# Altium project DRAGAO_MK_TWO.PrjPcb
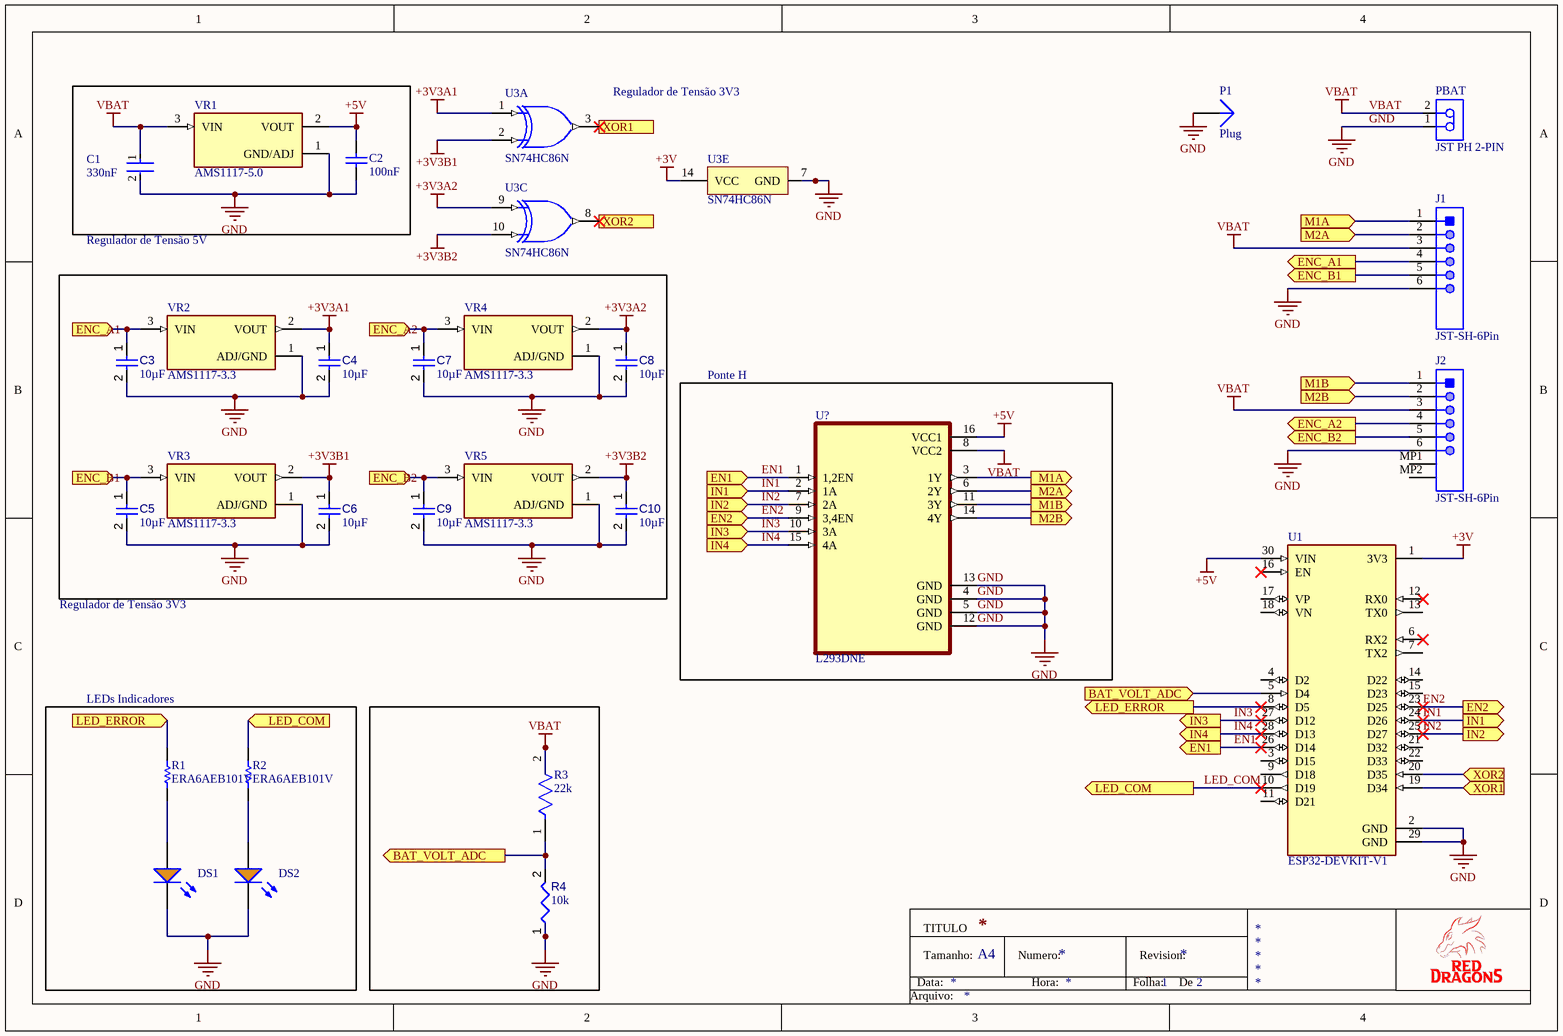
[diagram p0: Energia.SchDoc]
1 sheet, 28 parts. Net scope: flat (ports and power ports of the same name join across sheets).
Board file: PCB2.PcbDoc

## Sheet Energia.SchDoc
size A4; SheetNumber: 1; SheetTotal: 2

### Parts
C1  330nF  [FP-0805-L_2_01_0_2-W_1_25-IPC_B]
C2  100nF  [CAPC2013X140X50LL20T25]
C3  value 10µF  [CAPC2013X135X45NL10T25]  (hidden comment: Capacitor 10 uF +/- 10% 16 V 0805)
C4  value 10µF  [CAPC2013X135X45NL10T25]  (hidden comment: Capacitor 10 uF +/- 10% 16 V 0805)
C5  value 10µF  [CAPC2013X135X45NL10T25]  (hidden comment: Capacitor 10 uF +/- 10% 16 V 0805)
C6  value 10µF  [CAPC2013X135X45NL10T25]  (hidden comment: Capacitor 10 uF +/- 10% 16 V 0805)
C7  value 10µF  [CAPC2013X135X45NL10T25]  (hidden comment: Capacitor 10 uF +/- 10% 16 V 0805)
C8  value 10µF  [CAPC2013X135X45NL10T25]  (hidden comment: Capacitor 10 uF +/- 10% 16 V 0805)
C9  value 10µF  [CAPC2013X135X45NL10T25]  (hidden comment: Capacitor 10 uF +/- 10% 16 V 0805)
C10  value 10µF  [CAPC2013X135X45NL10T25]  (hidden comment: Capacitor 10 uF +/- 10% 16 V 0805)
DS1  LTST-C190KFKT  [LTST-C190KFKT_V]  (value not drawn)
DS2  LTST-C190KFKT  [LTST-C190KFKT_V]  (value not drawn)
J1  JST-SH-6Pin  [JST-SM06B-SRSS-TB_V]
J2  JST-SH-6Pin  [JST-SM06B-SRSS-TB_V]
P1  Plug  [PIN1]
PBAT  JST PH 2-PIN  [JST-B2B-PH-K-S_V]
R1  ERA6AEB101V  [RESC2013X60X40ML20T25]
R2  ERA6AEB101V  [RESC2013X60X40ML20T25]
R3  22k  [FP-CR0805-IPC_B]
R4  value 10k  [RESC2013X50X35ML15T15]  (hidden comment: Resistor 10k +/-1% 0805 125 mW)
U1  ESP32-DEVKIT-V1  [MODULE_ESP32_DEVKIT_V1]
U3  SN74HC86N  [N0014A]  (parts A,C,E of 5)
U?  L293DNE  [DIP762W45P254L1980H508Q16]
VR1  AMS1117-5.0  [SOT229P700X180-4N]
VR2  AMS1117-3.3  [SOT229P700X180-4N]
VR3  AMS1117-3.3  [SOT229P700X180-4N]
VR4  AMS1117-3.3  [SOT229P700X180-4N]
VR5  AMS1117-3.3  [SOT229P700X180-4N]

### Blocks framed on the sheet
Ponte H: U?
LEDs Indicadores: DS1 DS2 R1 R2

### Ports
BAT_VOLT_ADC (in), BAT_VOLT_ADC (out), EN1 (in), EN1 (out), EN2 (in), EN2 (out), ENC_A1 (in), ENC_A1 (out), ENC_A2 (in), ENC_A2 (out), ENC_B1 (in), ENC_B1 (out), ENC_B2 (in), ENC_B2 (out), IN1 (in), IN1 (out), IN2 (in), IN2 (out), IN3 (in), IN3 (out), IN4 (in), IN4 (out), LED_COM (in), LED_COM (out), LED_ERROR (in), LED_ERROR (out), M1A (in), M1A (out), M1B (in), M1B (out), M2A (in), M2A (out), M2B (in), M2B (out), XOR1 (in), XOR1 (out), XOR2 (in), XOR2 (out)

### Nets
+3V: U1.1(3V3) U3.14(VCC)
+3V3A1: C4.1 U3.1(1A) VR2.2(VOUT)
+3V3A2: C8.1 U3.9(3A) VR4.2(VOUT)
+3V3B1: C6.1 U3.2(1B) VR3.2(VOUT)
+3V3B2: C10.1 U3.10(3B) VR5.2(VOUT)
+5V: C2.2 U1.30(VIN) U?.16(VCC1) VR1.2(VOUT)
GND: C1.2 C2.1 C3.2 C4.2 C5.2 C6.2 C7.2 C8.2 C9.2 C10.2 DS1.2(K) DS2.2(K) J1.6 J2.6 P1.1 PBAT.1 R4.1 U1.2(GND) U1.29(GND) U3.7(GND) U?.4(GND) U?.5(GND) U?.12(GND) U?.13(GND) VR1.1(GND/ADJ) VR2.1(ADJ/GND) VR3.1(ADJ/GND) VR4.1(ADJ/GND) VR5.1(ADJ/GND)
VBAT: C1.1 J1.3 J2.3 PBAT.2 R3.2 U?.8(VCC2) VR1.3(VIN)
EN1: U1.26(D14) U?.1(1,2EN) ; port EN1
EN2: U1.23(D25) U?.9(3,4EN) ; port EN2
IN1: U1.24(D26) U?.2(1A) ; port IN1
IN2: U1.25(D27) U?.7(2A) ; port IN2
IN3: U1.27(D12) U?.10(3A) ; port IN3
IN4: U1.28(D13) U?.15(4A) ; port IN4
LED_COM: R2.2 U1.10(D19) ; port LED_COM
NetC3_1: C3.1 J1.4 VR2.3(VIN) ; port ENC_A1
NetC5_1: C5.1 J1.5 VR3.3(VIN) ; port ENC_B1
NetC7_1: C7.1 J2.4 VR4.3(VIN) ; port ENC_A2
NetC9_1: C9.1 J2.5 VR5.3(VIN) ; port ENC_B2
NetDS1_1: DS1.1(A) R1.1
NetDS2_1: DS2.1(A) R2.1
NetJ1_1: J1.1 U?.3(1Y) ; port M1A
NetJ1_2: J1.2 U?.6(2Y) ; port M2A
NetJ2_1: J2.1 U?.11(3Y) ; port M1B
NetJ2_2: J2.2 U?.14(4Y) ; port M2B
NetR1_2: R1.2 U1.8(D5) ; port LED_ERROR
NetR3_1: R3.1 R4.2 U1.5(D4) ; port BAT_VOLT_ADC
NetU1_19: U1.19(D34) U3.3(1Y) ; port XOR1
NetU1_20: U1.20(D35) U3.8(3Y) ; port XOR2

Not connected (* = marked no-connect by the designer): J2 MP1 MP2; U1 3(D15) 4(D2) 6(RX2)* 7(TX2) 9(D18) 11(D21) 12(RX0)* 13(TX0) 14(D22) 15(D23) 16(EN)* 17(VP) 18(VN) 21(D32) 22(D33)

### Notes on the sheet
- (near U3) Regulador de Tensão 3V3
- Regulador de Tensão 5V
- Regulador de Tensão 3V3
- Data:
- TITULO
- Tamanho:
- A4
- Numero:
- Hora:
- Folha:
- Revision:
- De
- Arquivo:

### Library data of the parts
C1 = CMP-2007-04657-2: General Purpose Ceramic Capacitor, 0805, 330nF, 10%, X7R, 15%, 16V; Dissipation Factor: 3.5%; Insulation Resistance: 100GR; RoHS Compliant: Yes; Tolerance: 10%; Packaging: Tape and Reel; Radiation Hardening: No; Depth: 1.25mm; Voltage Rating (DC): 16V; Height: 1.4mm; Package Quantity: 1; Case Code (Imperial): 0805; Min Operating Temperature: -55°C; Thickness: 0.055inch; REACH SVHC: No SVHC; Capacitance: 330nF; Voltage Rating: 16V; Size: 1.4mm; Case Code (Metric): 2012; Width: 1.25mm; Max Operating Temperature: 125°C; Voltage: 16V; Series: -; Mount: Surface Mount; Dielectric: X7R; Termination: SMD/SMT; Number of Pins: 2; Contact Plating: Tin; Lead Free: Lead Free; Construction: Flat; Case/Package: 0805; Length: 2.01mm
C2 = CMP-2007-04746-1: Manufacturer: AVX Interconnect / Elco; Part Number: 08055C104K4T4A
C3-C10 = CMP-001-00015-6: Chip Capacitor, 10 uF, +/- 10%, 16 V, 0805 (2012 Metric); Voltage Rating: 16V; Capacitor Type: Ceramic; RoHS Compliant: True; Max Operating Temperature: 85°C; Min Operating Temperature: -55°C; Mounting Technology: SM; Tolerance: 10%; Case/Package: 0805; Pins: 2
DS1 DS2 = CMP-007-00023-2: LED Uni-Color Orange, 75 mW, 30 mA, -35 to 85 degC, 2-Pin SMD, RoHS, Tape and Reel; Manufacturer: Lite-On; Power: 75mW; Luminous Intensity: 90mcd; Nominal Vf: 2V; Lens Style: Diffused; Forward Current: 20mA; Viewing Angle: 130degrees; Max Operating Temperature: 85°C; Manufacturer URL: http://www.us.liteon.com/; Package Description: 2-Pin Surface Mount Device, Body 1.6 x 0.8 mm; Package Quantity: 3000; Pins: 2; Min Operating Temperature: -55°C; Mounting Technology: SM; Colour: Orange; Packaging: TapeandReel; Case/Package: 0603; Datasheet Version: Rev. I, 09/2011; Illumination Colour: Orange; Datasheet URL: http://optoelectronics.liteon.com/upload/download/DS-22-99-0186/S_110_LTST-C190KFKT.pdf; Package Reference: C190KFKT; RoHS Compliant: True; Forward Voltage: 2V
J1 J2 = CMP-2000-07080-1: Male Header, Pitch 1 mm, 1 x 6 Position, Height 2.95 mm, -25 to 85 degC, RoHS, Tape and Reel; Manufacturer: JST; No of Positions: 6; Pitch: 1mm; Style/Orientation: RightAngleHeader/Plug; Datasheet URL: https://datasheet.ciiva.com/26894/getdatasheetpartid-708885-26894671.pdf; Package Description: Male Header, Pitch 1 mm, 1 X 6 Position, Height 2.9 mm; Termination: Solder; Manufacturer URL: http://www.jst.com/home2.html; Type: ShroudedHeader; Package Reference: SM06B-SRSS-TB; Datasheet Version: 11/2010; Mounting Technology: SurfaceMount
PBAT = CMP-2000-05162-1: Male Header, Pitch 2 mm, 1 x 2 Position, Height 6 mm, Tail Length 3.4 mm, -25 to 85 degC, RoHS, Bulk; Pitch: 2mm; Style/Orientation: StraightHeader/Plug; No of Positions: 2; Datasheet Version: Nov-08; Datasheet URL: http://datasheet.octopart.com/B2B-PH-K-S%28LF%29%28SN%29-JST-datasheet-8324864.pdf; Manufacturer URL: http://www.jst.com/home2.html; Type: ShroudedHeader; Termination: Crimp; Manufacturer: JST
R1 R2 = CMP-2001-00580-1: Manufacturer: Panasonic; Part Number: ERA6AEB101V
R3 = CMP-07231-001007-1: Thick Film Chip Resistors 0805 22kΩ 0.125W 5% 200ppm/°C; Voltage Rating: 150V; Resistance: 22kR; Power Rating: 125mW; Width: 1.25mm; Packaging: Tape and Reel; Max Operating Temperature: 155°C; Case/Package: 0805; Length: 2mm; Thickness: 508um; Military Standard: Not; Height: 0.5mm; Case Code (Metric): 2012; Radiation Hardening: No; Mount: Surface Mount; Temperature Coefficient: 200ppm/°C; Tolerance: 5%; Package Quantity: 5000; Contact Plating: Tin; Depth: 1.25mm; Termination: SMD/SMT; Composition: Thick Film; Case Code (Imperial): 0805; Min Operating Temperature: -55°C
R4 = CMP-009-00018-5: Chip Resistor, 10 KOhm, +/- 1%, 125 mW, -55 to 155 degC, 0805 (2012 Metric); Power: 125mW; Voltage Rating: 150V; Tolerance: 1%; Pins: 2; Min Operating Temperature: -55°C; Case/Package: 0805; Max Operating Temperature: 155°C; RoHS Compliant: True; Mounting Technology: SM
U1 = ESP32-DEVKIT-V1: Dual core, Wi-Fi: 2.4 GHz up to 150 Mbits/s,BLE (Bluetooth Low Energy) and legacy Bluetooth, 32 bits, Up to 240 MHz; MF: {'manufacturer': u'Do it'}; Availability: Unavailable; Price: None; Value: *; MP: ESP32-DEVKIT-V1; Package: None
U3 = CMP-024-00000-1: 4-ch, 2-input, 2-V to 6-V XOR (exclusive OR) gates 14-PDIP -40 to 85
U? = L293DNE: MF: {'manufacturer': u'Texas Instruments'}; Value: *; MP: L293DNE; Package: None; Availability: Unavailable; Price: None
VR1 = AMS1117-5.0: MF: {'manufacturer': u'ams'}; Value: *; Availability: Unavailable; Package: None; Price: None; MP: AMS1117-5.0
VR2-VR5 = AMS1117-3.3: Sot223/Pkg 1-Amp 3.3-Volt Low Drop Out Voltage Regulatator; MF: {'manufacturer': u'Advanced Monolithic Systems'}; Price: None; Package: None; Availability: Unavailable; Value: *; MP: AMS1117-3.3
P1 = Plug: LatestRevisionDate: 17-Jul-2002; LatestRevisionNote: Re-released for DXP Platform.; Publisher: Altium Limited